# Altium schematic sheet Power and MCU.SchDoc
size 381 x 241 mm; SheetNumber: 1; SheetTotal: 1
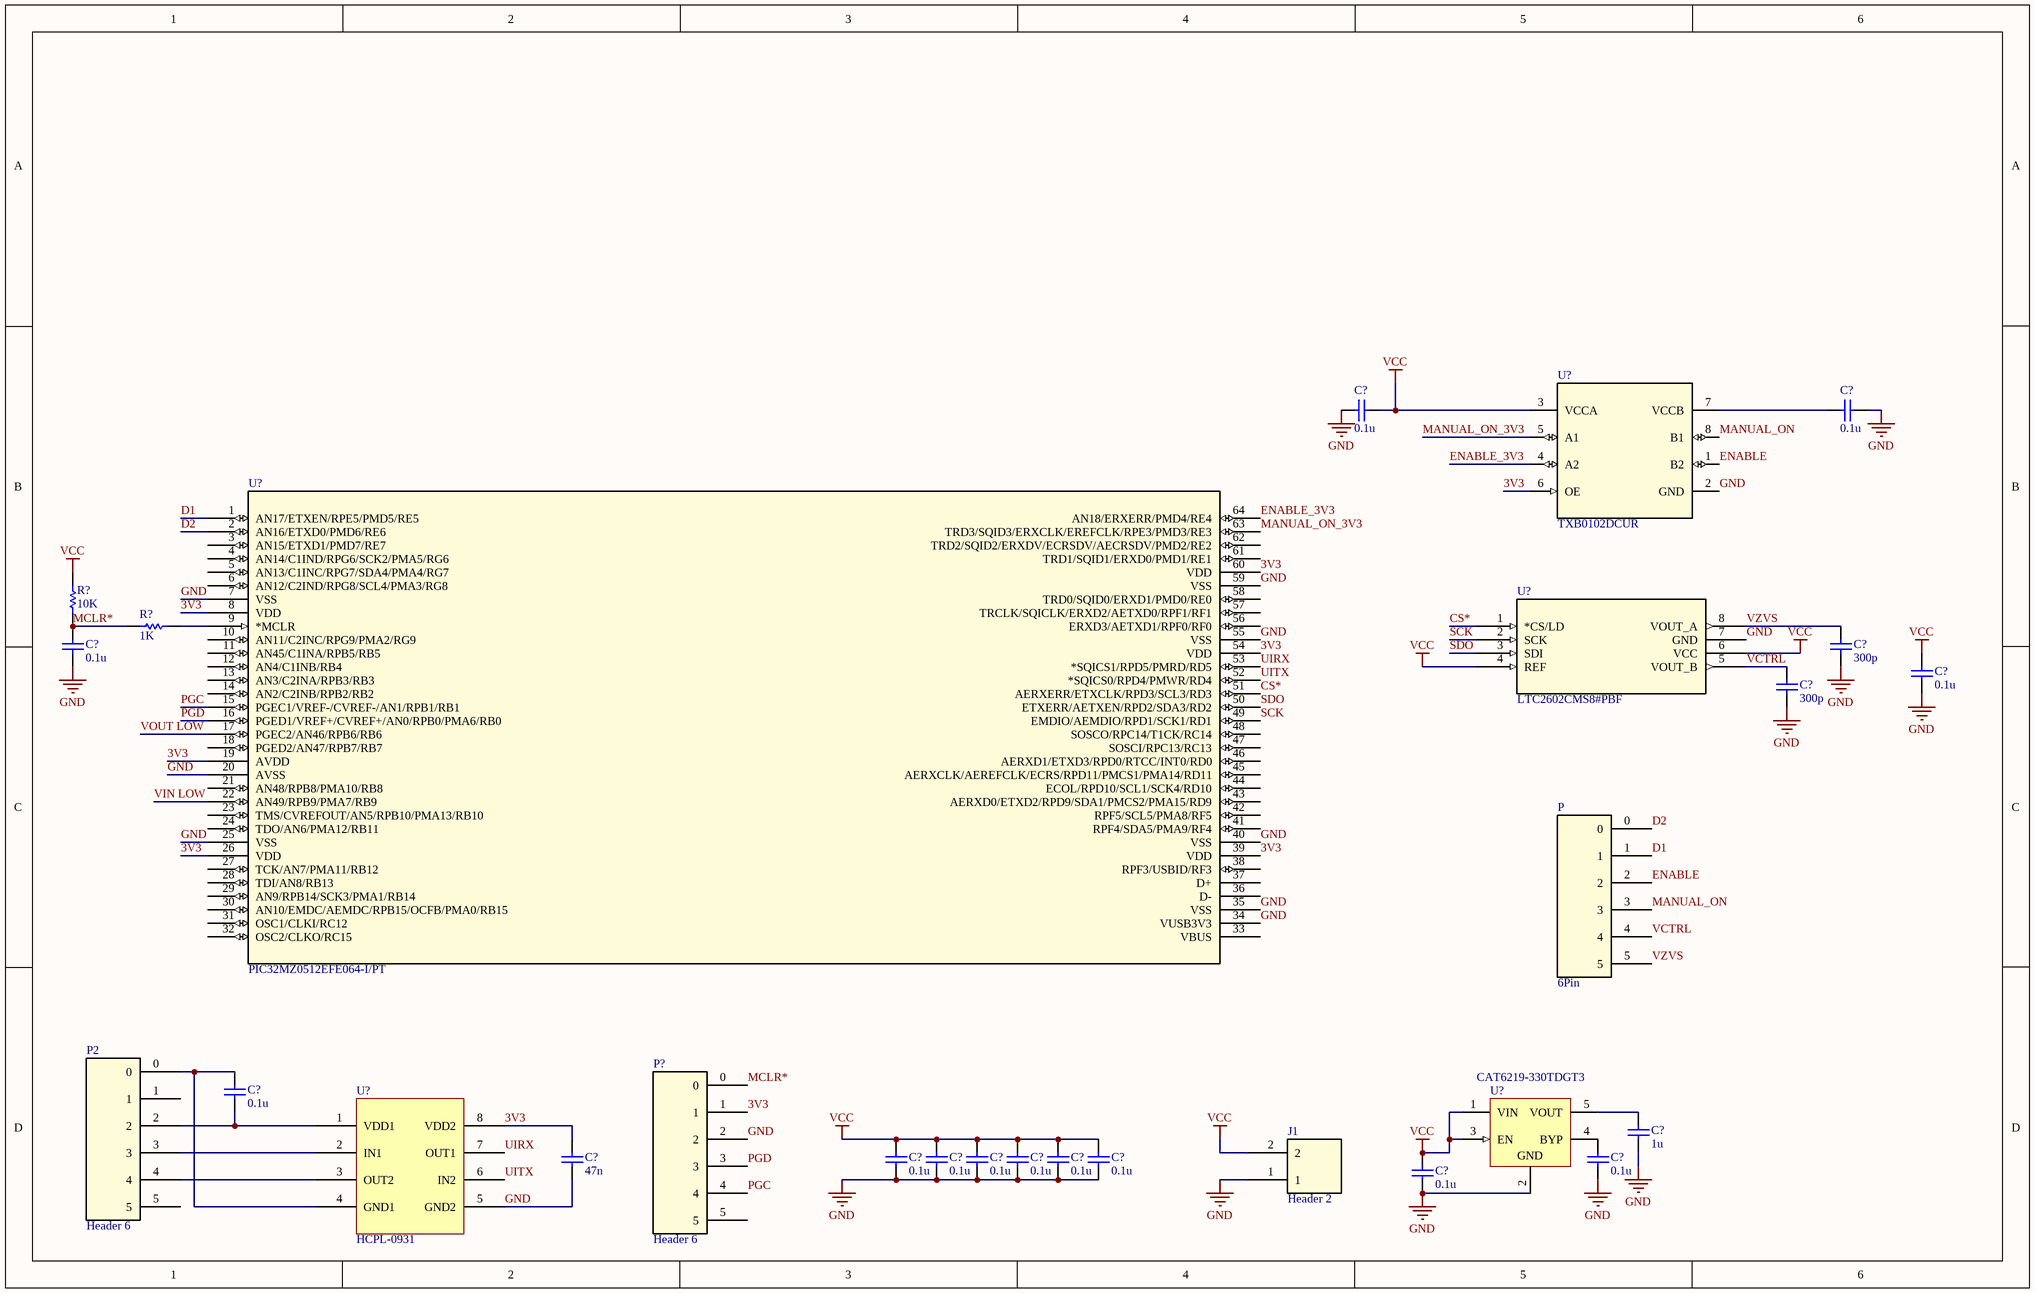
[diagram p0: Power and MCU.SchDoc]

## Parts
(Parts that share a designator on the sheet are numbered #1, #2 ... from top to bottom, then left to right.)
C?#1  value 0.1u  (hidden comment: Capacitor)
C?#2  value 0.1u  (hidden comment: Capacitor)
C?#3  value 0.1u  (hidden comment: Capacitor)
C?#4  value 300p  (hidden comment: Capacitor)
C?#5  value 0.1u  (hidden comment: Capacitor)
C?#6  value 300p  (hidden comment: Capacitor)
C?#7  value 0.1u  (hidden comment: Capacitor)
C?#8  value 1u  (hidden comment: Capacitor)
C?#9  value 47n  (hidden comment: Capacitor)
C?#10  value 0.1u  (hidden comment: Capacitor)
C?#11  value 0.1u  (hidden comment: Capacitor)
C?#12  value 0.1u  (hidden comment: Capacitor)
C?#13  value 0.1u  (hidden comment: Capacitor)
C?#14  value 0.1u  (hidden comment: Capacitor)
C?#15  value 0.1u  (hidden comment: Capacitor)
C?#16  value 0.1u  (hidden comment: Capacitor)
C?#17  value 0.1u  (hidden comment: Capacitor)
J1  Header 2  [2 pin Terminal - pitch 1.27mm]
P  6Pin  [6 pin Terminal - pitch 2.54mm]
P2  Header 6  [6 pin Terminal - pitch 2.54mm]
P?  Header 6  [6 pin Terminal - pitch 2.54mm]
R?#1  value 10K  (hidden comment: Resistor)
R?#2  value 1K  (hidden comment: Resistor)
U?#1  TXB0102DCUR  [DCU0008A_N]
U?#2  PIC32MZ0512EFE064-I/PT  [TQFP64_PT_MCH]
U?#3  LTC2602CMS8#PBF  [MSOP-8_MS_LIT]
U?#4  CAT6219-330TDGT3  [ONSC-SOT23-5_L]
U?#5  HCPL-0931  [SOIC-8]

## Nets
GND: C?#1.2 C?#2.1 C?#3.1 C?#4.1 C?#5.1 C?#6.1 C?#8.1 C?#9.1 C?#10.1 C?#11.1 C?#12.1 C?#13.1 C?#14.1 C?#15.1 C?#16.1 C?#17.1 J1.1 P?.2 U?#1.2(GND) U?#2.7(VSS) U?#2.20(AVSS) U?#2.25(VSS) U?#2.34(VUSB3V3) U?#2.35(VSS) U?#2.40(VSS) U?#2.55(VSS) U?#2.59(VSS) U?#3.7(GND) U?#4.2(GND) U?#5.5(GND2)
VCC: C?#1.1 C?#5.2 C?#10.2 C?#11.2 C?#12.2 C?#13.2 C?#14.2 C?#15.2 C?#17.2 J1.2 R?#1.2 U?#1.3(VCCA) U?#3.4(REF) U?#3.6(VCC) U?#4.1(VIN) U?#4.3(EN)
3V3: C?#9.2 P?.1 U?#1.6(OE) U?#2.8(VDD) U?#2.19(AVDD) U?#2.26(VDD) U?#2.39(VDD) U?#2.54(VDD) U?#2.60(VDD) U?#5.8(VDD2)
CS*: U?#2.51(AERXERR/ETXCLK/RPD3/SCL3/RD3) U?#3.1(*CS/LD)
D1: P.1 U?#2.1(AN17/ETXEN/RPE5/PMD5/RE5)
D2: P.0 U?#2.2(AN16/ETXD0/PMD6/RE6)
ENABLE: P.2 U?#1.1(B2)
ENABLE_3V3: U?#1.4(A2) U?#2.64(AN18/ERXERR/PMD4/RE4)
MANUAL_ON: P.3 U?#1.8(B1)
MANUAL_ON_3V3: U?#1.5(A1) U?#2.63(TRD3/SQID3/ERXCLK/EREFCLK/RPE3/PMD3/RE3)
MCLR*: C?#3.2 P?.0 R?#1.1 R?#2.1
PGC: P?.4 U?#2.15(PGEC1/VREF-/CVREF-/AN1/RPB1/RB1)
PGD: P?.3 U?#2.16(PGED1/VREF+/CVREF+/AN0/RPB0/PMA6/RB0)
SCK: U?#2.49(EMDIO/AEMDIO/RPD1/SCK1/RD1) U?#3.2(SCK)
SDO: U?#2.50(ETXERR/AETXEN/RPD2/SDA3/RD2) U?#3.3(SDI)
UIRX: U?#2.53(*SQICS1/RPD5/PMRD/RD5) U?#5.7(OUT1)
UITX: U?#2.52(*SQICS0/RPD4/PMWR/RD4) U?#5.6(IN2)
VCTRL: C?#6.2 P.4 U?#3.5(VOUT_B)
VIN LOW: U?#2.22(AN49/RPB9/PMA7/RB9)
VOUT LOW: U?#2.17(PGEC2/AN46/RPB6/RB6)
VZVS: C?#4.2 P.5 U?#3.8(VOUT_A)
NetC?#2_2: C?#2.2 U?#1.7(VCCB)
NetC?#7_1: C?#7.1 P2.2 U?#5.1(VDD1)
NetC?#7_2: C?#7.2 P2.0 U?#5.4(GND1)
NetC?#8_2: C?#8.2 U?#4.5(VOUT)
NetC?#16_2: C?#16.2 U?#4.4(BYP)
NetP2_3: P2.3 U?#5.2(IN1)
NetP2_4: P2.4 U?#5.3(OUT2)
NetR?#2_2: R?#2.2 U?#2.9(*MCLR)

Not connected (* = marked no-connect by the designer): P2 1 5; P? 5; U?#2 3(AN15/ETXD1/PMD7/RE7) 4(AN14/C1IND/RPG6/SCK2/PMA5/RG6) 5(AN13/C1INC/RPG7/SDA4/PMA4/RG7) 6(AN12/C2IND/RPG8/SCL4/PMA3/RG8) 10(AN11/C2INC/RPG9/PMA2/RG9) 11(AN45/C1INA/RPB5/RB5) 12(AN4/C1INB/RB4) 13(AN3/C2INA/RPB3/RB3) 14(AN2/C2INB/RPB2/RB2) 18(PGED2/AN47/RPB7/RB7) 21(AN48/RPB8/PMA10/RB8) 23(TMS/CVREFOUT/AN5/RPB10/PMA13/RB10) 24(TDO/AN6/PMA12/RB11) 27(TCK/AN7/PMA11/RB12) 28(TDI/AN8/RB13) 29(AN9/RPB14/SCK3/PMA1/RB14) 30(AN10/EMDC/AEMDC/RPB15/OCFB/PMA0/RB15) 31(OSC1/CLKI/RC12) 32(OSC2/CLKO/RC15) 33(VBUS) 36(D-) 37(D+) 38(RPF3/USBID/RF3) 41(RPF4/SDA5/PMA9/RF4) 42(RPF5/SCL5/PMA8/RF5) 43(AERXD0/ETXD2/RPD9/SDA1/PMCS2/PMA15/RD9) 44(ECOL/RPD10/SCL1/SCK4/RD10) 45(AERXCLK/AEREFCLK/ECRS/RPD11/PMCS1/PMA14/RD11) 46(AERXD1/ETXD3/RPD0/RTCC/INT0/RD0) 47(SOSCI/RPC13/RC13) 48(SOSCO/RPC14/T1CK/RC14) 56(ERXD3/AETXD1/RPF0/RF0) 57(TRCLK/SQICLK/ERXD2/AETXD0/RPF1/RF1) 58(TRD0/SQID0/ERXD1/PMD0/RE0) 61(TRD1/SQID1/ERXD0/PMD1/RE1) 62(TRD2/SQID2/ERXDV/ECRSDV/AECRSDV/PMD2/RE2)

## Library data of the parts
C?#1-C?#17 = Capacitor: SimulationGenericComponent: True
J1 = 2 pin Terminal: ComponentLink1: http://www.digikey.com/scripts/DkSearch/dksus.dll?Detail&itemSeq=195945201&uq=635977101282764137
P P2 P? = 6 pin Terminal: ComponentLink1: http://www.digikey.com/product-detail/en/te-connectivity-amp-connectors/3-644456-6/A31116-ND/698348
R?#1 R?#2 = Resistor: TC1: 0; SimulationGenericComponent: True; TC2: 0
U?#1 = TXB0102DCUR: 2-Bit Bidirectional Voltage-Level Shifter with Auto Direction Sensing and +/-15-kV ESD Protect 8-VSSOP -40 to 85; Manufacturer_Name: Texas Instruments; Alternate_PartNumber: TXB0102DCUT; CompType: IC; TYPE: TYPE; RefDes: RefDes; Copyright: Copyright (C) 2025 Ultra Librarian. All rights reserved.; Manufacturer_Part_Number: TXB0102DCUR; PartNumber: TXB0102DCUR; PackageReference: DCU0008A; MountType: SMT; RoHS: Y; Manufacturer: Texas Instruments
U?#2 = PIC32MZ0512EFE064-IPT: No Description Available; Manufacturer_Name: Microchip; Copyright: Copyright (C) 2025 Ultra Librarian. All rights reserved.; Manufacturer_Part_Number: PIC32MZ0512EFE064-I/PT; RefDes: RefDes; Type: Type
U?#3 = LTC2602CMS8PBF: Dual 16-Bit Rail-to-Rail DACs in 8-Lead MSOP; Manufacturer_Name: Analog Devices Inc; Copyright: Copyright (C) 2025 Ultra Librarian. All rights reserved.; Manufacturer_Part_Number: LTC2602CMS8#PBF; Datasheet: https://www.analog.com/media/en/technical-documentation/data-sheets/2602fa.pdf; RefDes: RefDes; Type: Type
U?#4 = CMP-0273-00001-2: Fixed Low Drop Positive Voltage Regulator, 3.3V, 5-Pin TSOT-23, Tape and Reel; Manufacturer: ON Semiconductor; PSRR (dB): 64; VI Max (V): 5.5; Output: Single; Iq Typ (mA): 0.085; Noise (uVrms): 45; VDO Typ (V): 0.3; Io Typ(A): 0.5; Vo(V): 3.3; Polarity: Positive; DatasheetVersion: Rev. 14; Package Type: TSOT-23-5; RoHS: Pb-free; Mounting Technology: Surface Mount; ComponentLink1URL: http://www.onsemi.com/; PartNumber: CAT6219-330TDGT3; ComponentLink3Description: Package Specification; ComponentLink2URL: http://www.onsemi.com/pub_link/Collateral/CAT6219-D.PDF; ComponentLink3URL: http://www.onsemi.com/pub_link/Collateral/419AE.PDF; PackageVersion: Rev. O; ComponentLink1Description: Manufacturer URL; PackageReference: TSOT-23; ComponentLink2Description: Datasheet; PackageDescription: 5-Pin Plastic Small Outline Package, Body 2.9 x 1.6mm, Pitch 0.95mm
U?#5 = HCPL-0931: ComponentLink: http://www.digikey.com/product-detail/en/broadcom-limited/HCPL-0931/516-2702-5-ND/969355